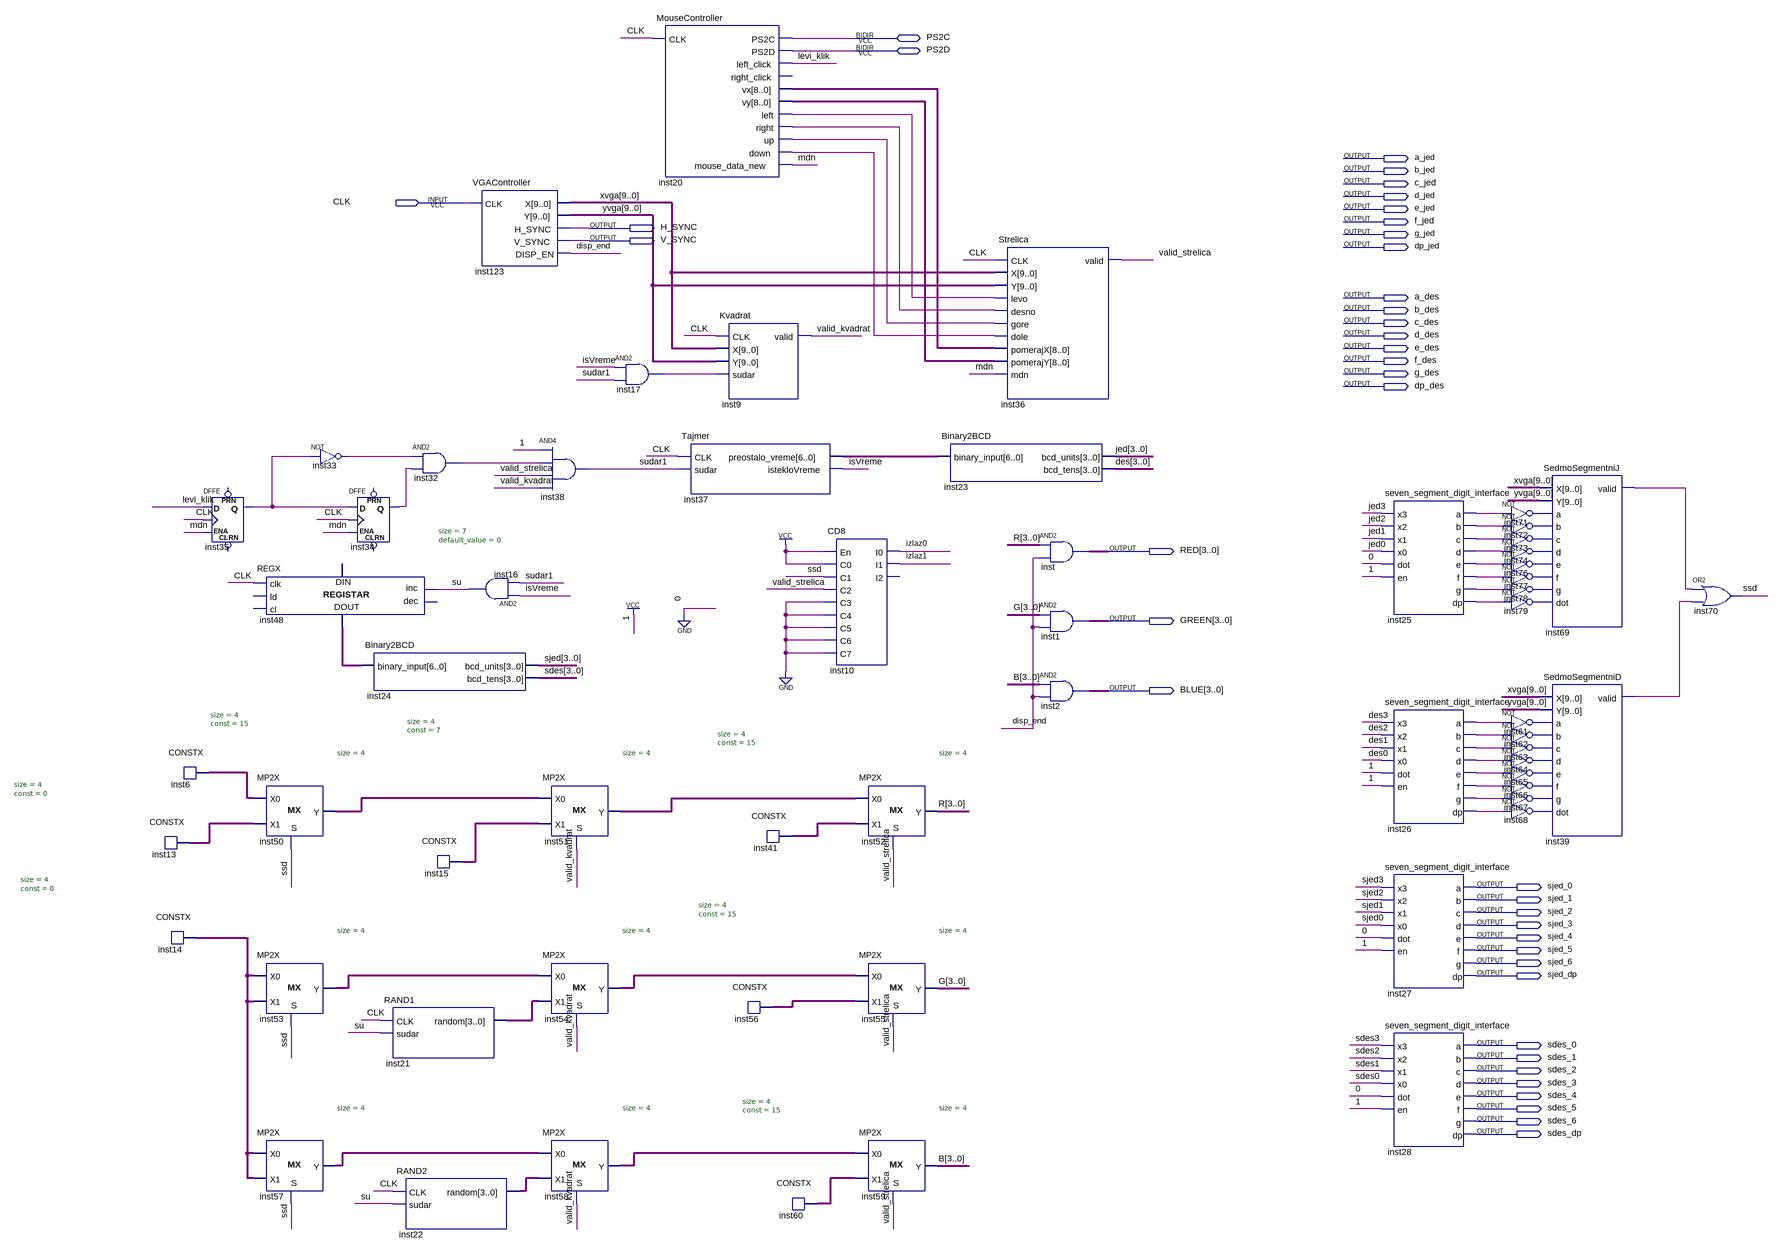
[diagram p0: schematic sheet]
// Quartus schematic FPGprojekat.bdf as structural Verilog: 60 symbols, 40 pins
module FPGprojekat (
  input  CLK,
  inout  PS2C,
  inout  PS2D,
  output a_jed,
  output b_jed,
  output c_jed,
  output d_jed,
  output e_jed,
  output f_jed,
  output H_SYNC,
  output g_jed,
  output V_SYNC,
  output dp_jed,
  output a_des,
  output b_des,
  output c_des,
  output d_des,
  output e_des,
  output f_des,
  output g_des,
  output dp_des,
  output [3:0] RED,
  output [3:0] GREEN,
  output [3:0] BLUE,
  output sjed_0,
  output sjed_1,
  output sjed_2,
  output sjed_3,
  output sjed_4,
  output sjed_5,
  output sjed_6,
  output sjed_dp,
  output sdes_0,
  output sdes_1,
  output sdes_2,
  output sdes_3,
  output sdes_4,
  output sdes_5,
  output sdes_6,
  output sdes_dp
);

  wire disp_end, inst17_out, inst20_down, inst20_left, inst20_right, inst20_up, inst25_a, inst25_b, inst25_c,
       inst25_d, inst25_dp, inst25_e, inst25_f, inst25_g, inst26_a, inst26_b, inst26_c, inst26_d, inst26_dp,
       inst26_e, inst26_f, inst26_g, inst32_out, inst33_out, inst34_q, inst35_q, inst39_valid, inst61_out,
       inst62_out, inst63_out, inst64_out, inst65_out, inst66_out, inst67_out, inst68_out, inst69_valid,
       inst71_out, inst72_out, inst73_out, inst74_out, inst76_out, inst77_out, inst78_out, inst79_out,
       isVreme, izlaz0, izlaz1, levi_klik, mdn, ssd, su, sudar1, valid_kvadrat, valid_strelica;
  wire [3:0] B, des, G, inst6_data, inst13_data, inst14_data, inst15_data, inst21_random, inst22_random,
       inst41_data, inst50_y, inst51_y, inst53_y, inst54_y, inst56_data, inst57_y, inst58_y, inst60_data,
       jed, R, sdes, sjed;
  wire [6:0] inst37_preostalo_vreme, inst48_data_out;
  wire [8:0] inst20_vx, inst20_vy;
  wire [9:0] xvga, yvga;

  CONSTX #(.size(4), .\const (0)) inst13 (.data(inst13_data));
  CONSTX #(.size(4), .\const (0)) inst14 (.data(inst14_data));
  DFFE inst35 (.D(levi_klik), .CLK(CLK), .ENA(mdn), .Q(inst35_q));  // open: PRN, CLRN
  CONSTX #(.size(4), .\const (15)) inst6 (.data(inst6_data));
  REGX #(.size(7), .default_value(0)) inst48 (
    .clk(CLK), .inc(su), .data_out(inst48_data_out));  // open: ld, cl, dec, data_in
  MP2X #(.size(4)) inst50 (.S(ssd), .X0(inst6_data), .X1(inst13_data), .Y(inst50_y));
  MP2X #(.size(4)) inst53 (.S(ssd), .X0(inst14_data), .X1(inst14_data), .Y(inst53_y));
  MP2X #(.size(4)) inst57 (.S(ssd), .X0(inst14_data), .X1(inst14_data), .Y(inst57_y));
  not inst33 (inst33_out, inst35_q);
  DFFE inst34 (.D(inst35_q), .CLK(CLK), .ENA(mdn), .Q(inst34_q));  // open: PRN, CLRN
  Binary2BCD inst24 (.binary_input(inst48_data_out), .bcd_units(sjed), .bcd_tens(sdes));
  RAND1 inst21 (.CLK(CLK), .sudar(su), .random(inst21_random));
  RAND2 inst22 (.CLK(CLK), .sudar(su), .random(inst22_random));
  and inst32 (inst32_out, inst33_out, inst34_q);
  CONSTX #(.size(4), .\const (7)) inst15 (.data(inst15_data));
  VGAController inst123 (.CLK(CLK), .X(xvga), .Y(yvga), .H_SYNC(H_SYNC), .V_SYNC(V_SYNC), .DISP_EN(disp_end));
  and inst16 (su, isVreme, sudar1);
  and inst38 (sudar1, 1'b1, inst32_out, valid_strelica, valid_kvadrat);
  MP2X #(.size(4)) inst51 (.S(valid_kvadrat), .X0(inst50_y), .X1(inst15_data), .Y(inst51_y));
  MP2X #(.size(4)) inst54 (.S(valid_kvadrat), .X0(inst53_y), .X1(inst21_random), .Y(inst54_y));
  MP2X #(.size(4)) inst58 (.S(valid_kvadrat), .X0(inst57_y), .X1(inst22_random), .Y(inst58_y));
  MouseController inst20 (
    .CLK(CLK), .left_click(levi_klik), .vx(inst20_vx), .vy(inst20_vy), .left(inst20_left),
    .right(inst20_right), .up(inst20_up), .down(inst20_down), .mouse_data_new(mdn), .PS2C(PS2C), .PS2D(PS2D));  // open: right_click
  and inst17 (inst17_out, isVreme, sudar1);
  Tajmer inst37 (.CLK(CLK), .sudar(sudar1), .preostalo_vreme(inst37_preostalo_vreme), .istekloVreme(isVreme));
  Kvadrat inst9 (.CLK(CLK), .X(xvga), .Y(yvga), .sudar(inst17_out), .valid(valid_kvadrat));
  CONSTX #(.size(4), .\const (15)) inst41 (.data(inst41_data));
  CONSTX #(.size(4), .\const (15)) inst56 (.data(inst56_data));
  CONSTX #(.size(4), .\const (15)) inst60 (.data(inst60_data));
  CD8 inst10 (
    .En(1'b1), .C0(1'b1), .C1(ssd), .C2(valid_strelica), .C3(1'b0), .C4(1'b0), .C5(1'b0), .C6(1'b0),
    .C7(1'b0), .I0(izlaz0), .I1(izlaz1));  // open: I2
  MP2X #(.size(4)) inst52 (.S(valid_strelica), .X0(inst51_y), .X1(inst41_data), .Y(R));
  MP2X #(.size(4)) inst55 (.S(valid_strelica), .X0(inst54_y), .X1(inst56_data), .Y(G));
  MP2X #(.size(4)) inst59 (.S(valid_strelica), .X0(inst58_y), .X1(inst60_data), .Y(B));
  Binary2BCD inst23 (.binary_input(inst37_preostalo_vreme), .bcd_units(jed), .bcd_tens(des));
  Strelica inst36 (
    .CLK(CLK), .X(xvga), .Y(yvga), .levo(inst20_left), .desno(inst20_right), .gore(inst20_up),
    .dole(inst20_down), .pomerajX(inst20_vx), .pomerajY(inst20_vy), .mdn(mdn), .valid(valid_strelica));
  assign RED = R & {4{disp_end}};  // AND2 inst, 4 bits wide
  assign GREEN = G & {4{disp_end}};  // AND2 inst1, 4 bits wide
  assign BLUE = B & {4{disp_end}};  // AND2 inst2, 4 bits wide
  seven_segment_digit_interface inst25 (
    .x3(jed[3]), .x2(jed[2]), .x1(jed[1]), .x0(jed[0]), .dot(1'b0), .en(1'b1), .a(inst25_a), .b(inst25_b),
    .c(inst25_c), .d(inst25_d), .e(inst25_e), .f(inst25_f), .g(inst25_g), .dp(inst25_dp));
  seven_segment_digit_interface inst26 (
    .x3(des[3]), .x2(des[2]), .x1(des[1]), .x0(des[0]), .dot(1'b1), .en(1'b1), .a(inst26_a), .b(inst26_b),
    .c(inst26_c), .d(inst26_d), .e(inst26_e), .f(inst26_f), .g(inst26_g), .dp(inst26_dp));
  seven_segment_digit_interface inst27 (
    .x3(sjed[3]), .x2(sjed[2]), .x1(sjed[1]), .x0(sjed[0]), .dot(1'b0), .en(1'b1), .a(sjed_0), .b(sjed_1),
    .c(sjed_2), .d(sjed_3), .e(sjed_4), .f(sjed_5), .g(sjed_6), .dp(sjed_dp));
  seven_segment_digit_interface inst28 (
    .x3(sdes[3]), .x2(sdes[2]), .x1(sdes[1]), .x0(sdes[0]), .dot(1'b0), .en(1'b1), .a(sdes_0), .b(sdes_1),
    .c(sdes_2), .d(sdes_3), .e(sdes_4), .f(sdes_5), .g(sdes_6), .dp(sdes_dp));
  not inst71 (inst71_out, inst25_a);
  not inst72 (inst72_out, inst25_b);
  not inst73 (inst73_out, inst25_c);
  not inst74 (inst74_out, inst25_d);
  not inst76 (inst76_out, inst25_e);
  not inst77 (inst77_out, inst25_f);
  not inst78 (inst78_out, inst25_g);
  not inst79 (inst79_out, inst25_dp);
  not inst61 (inst61_out, inst26_a);
  not inst62 (inst62_out, inst26_b);
  not inst63 (inst63_out, inst26_c);
  not inst64 (inst64_out, inst26_d);
  not inst65 (inst65_out, inst26_e);
  not inst66 (inst66_out, inst26_f);
  not inst67 (inst67_out, inst26_g);
  not inst68 (inst68_out, inst26_dp);
  SedmoSegmentniJ inst69 (
    .X(xvga), .Y(yvga), .a(inst71_out), .b(inst72_out), .c(inst73_out), .d(inst74_out), .e(inst76_out),
    .f(inst77_out), .g(inst78_out), .dot(inst79_out), .valid(inst69_valid));
  SedmoSegmentniD inst39 (
    .X(xvga), .Y(yvga), .a(inst61_out), .b(inst62_out), .c(inst63_out), .d(inst64_out), .e(inst65_out),
    .f(inst66_out), .g(inst67_out), .dot(inst68_out), .valid(inst39_valid));
  or inst70 (ssd, inst69_valid, inst39_valid);
endmodule
